# EasyEDA schematic schematic.json
TITLE: esp8266 wall wart; REV: 1.0; Date: 2017-07-03; Sheet: 1/1; Drawn By: gustavofbreunig
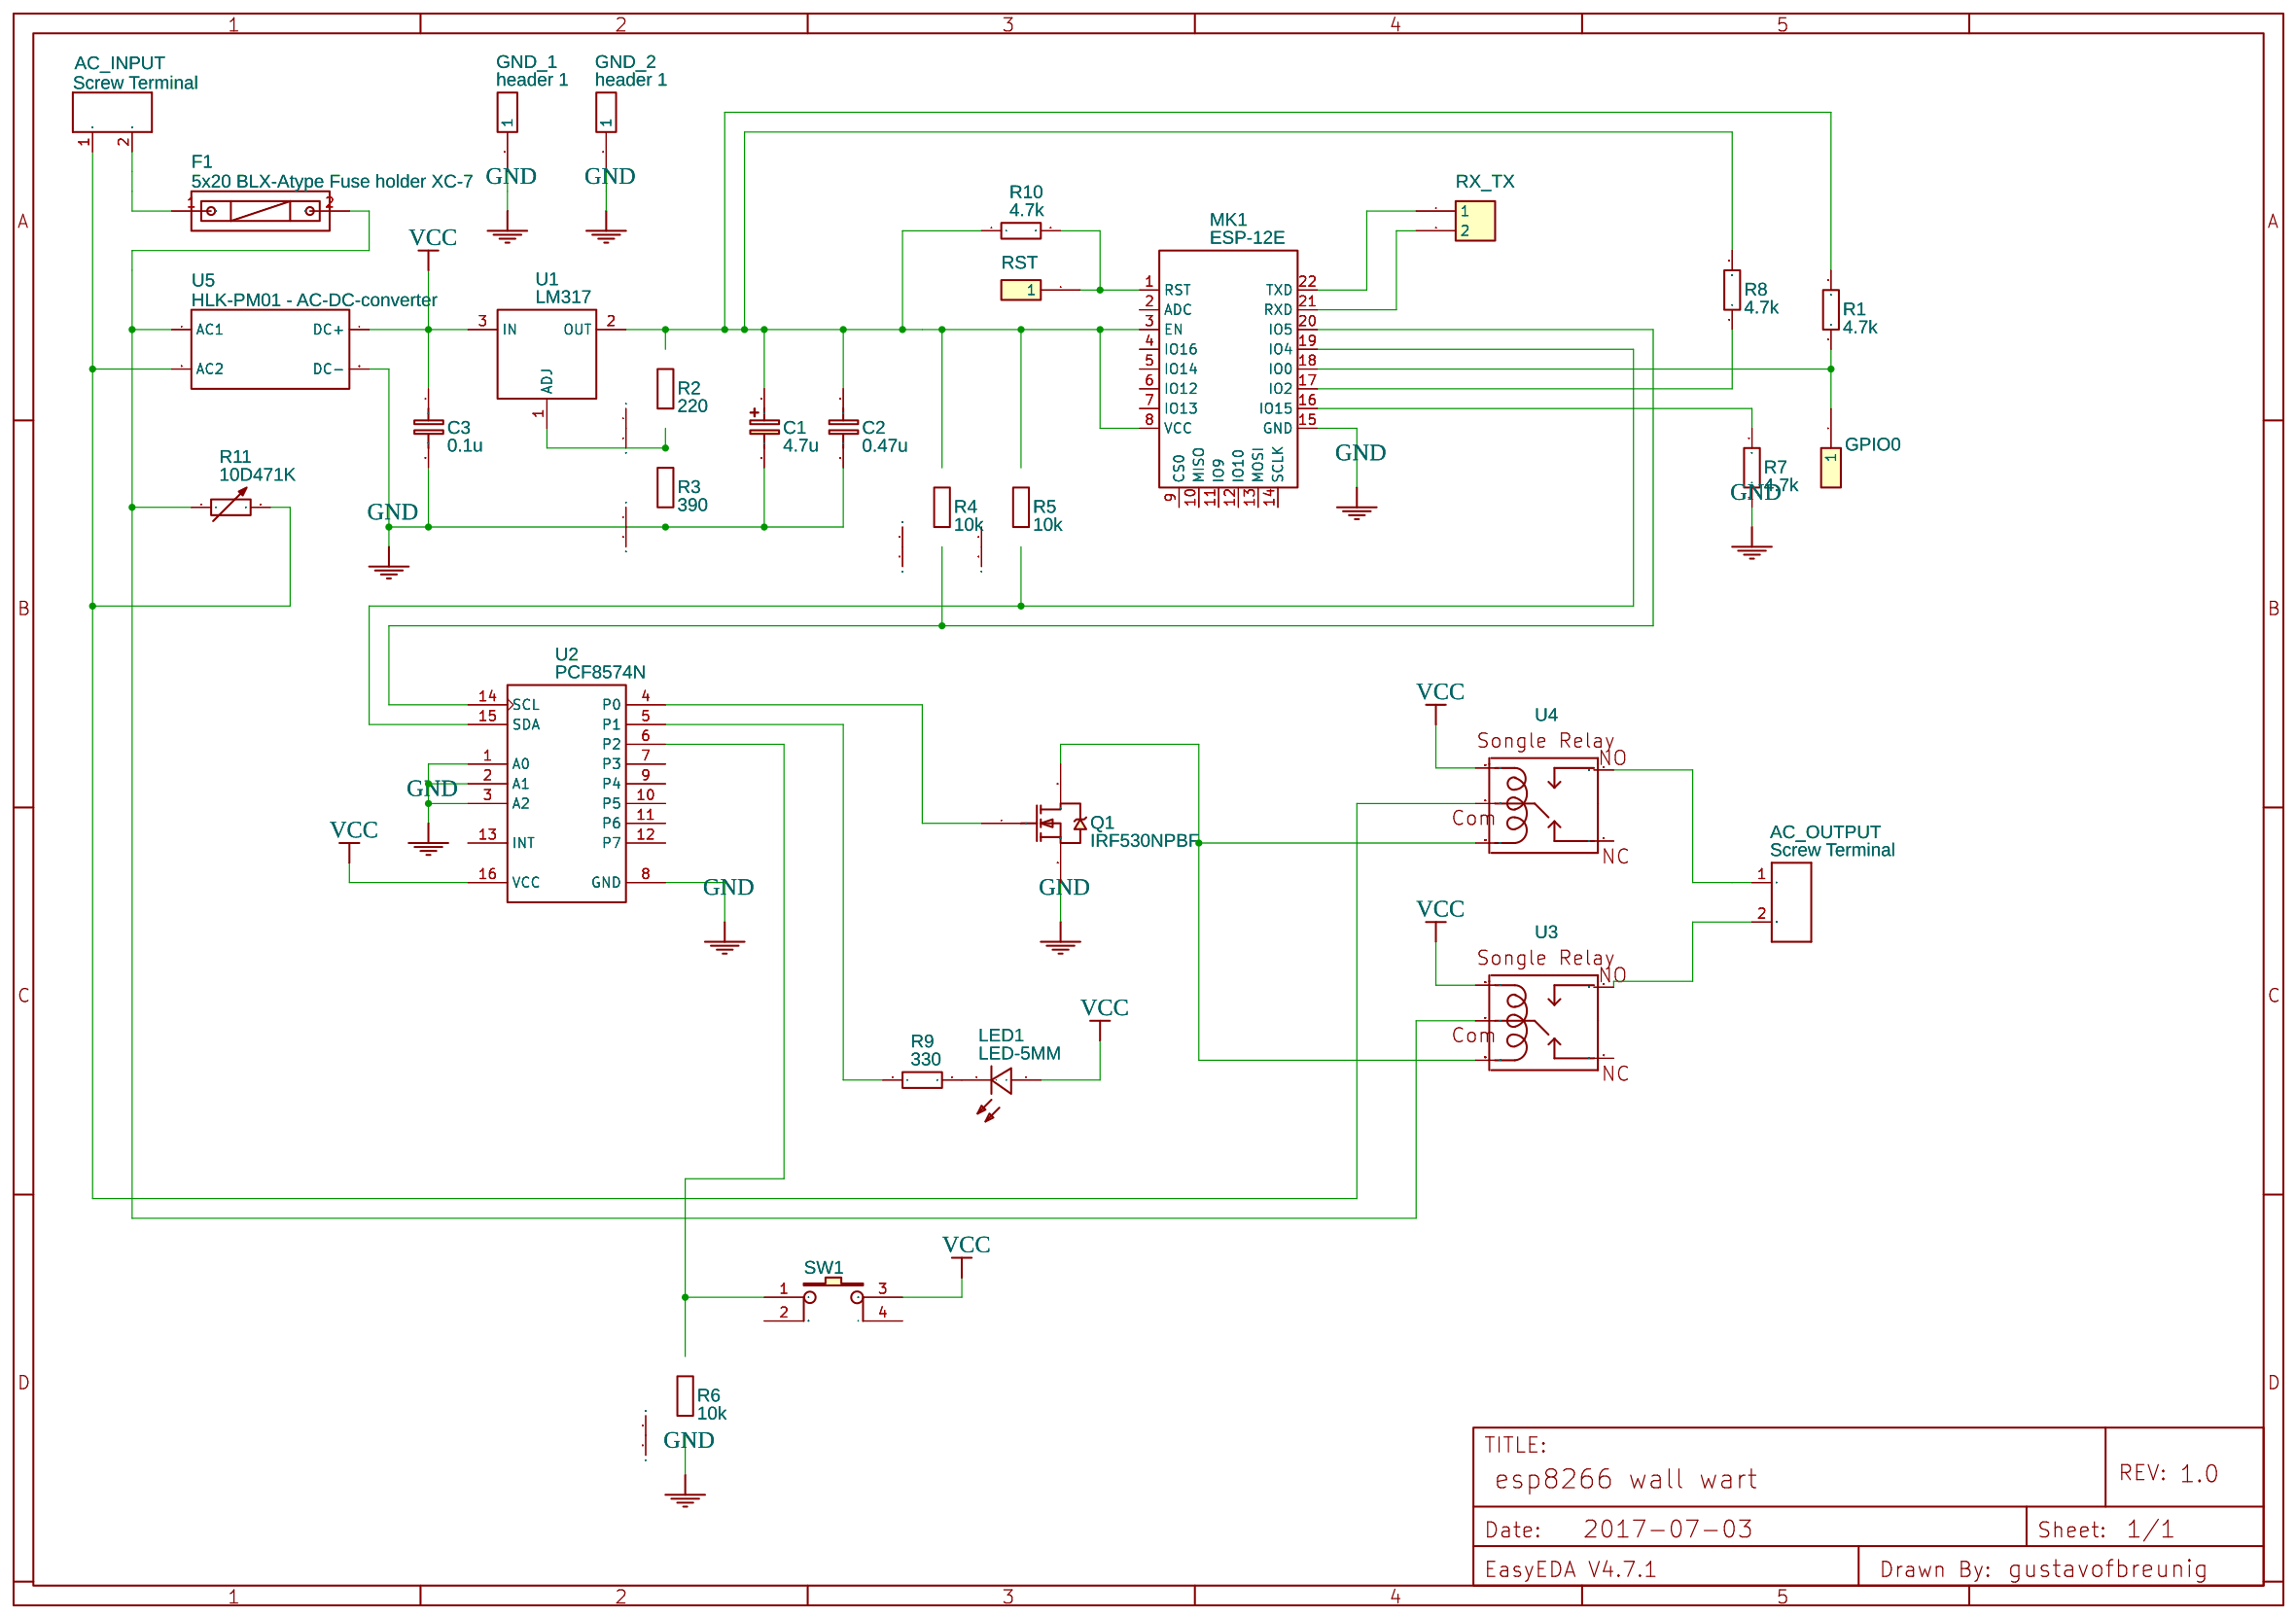
[diagram p0: schematic sheet]

## Parts
AC_INPUT  Screw Terminal  [H2-5.0-10.5X8.0MM]
AC_OUTPUT  Screw Terminal  [H2-5.0-10.5X8.0MM]
C1  4.7u  [CAP-D5.0XF2.0]
C2  0.47u  [RAD-0.1]
C3  0.1u  [RAD-0.1]
F1  5x20 BLX-Atype Fuse holder XC-7  [5X20-BLX-A]
GND_1  header 1  [HDR-1X1/2.54]
GND_2  header 1  [HDR-1X1/2.54]
GPIO0  Header-Male-2.54_1x1  [HDR-1X1/2.54]
LED1  LED-5MM  [LED-5MM/2.54]
MK1  ESP-12E  [ESP-12E]
Q1  IRF530NPBF  [TO-220(TO-220-3)]
R1  4.7k  [AXIAL-0.3]
R2  220  [AXIAL-0.3]
R3  390  [AXIAL-0.3]
R4  10k  [AXIAL-0.3]
R5  10k  [AXIAL-0.3]
R6  10k  [AXIAL-0.3]
R7  4.7k  [AXIAL-0.3]
R8  4.7k  [AXIAL-0.3]
R9  330  [AXIAL-0.3]
R10  4.7k  [AXIAL-0.3]
R11  10D471K  [PS-RES-12.5*6.7]
RST  Header-Male-2.54_1x1  [HDR-1X1/2.54]
RX_TX  Header-Female-2.54_1x2  [HDR-1X2/2.54]
SW1  SWITCH-6x6x5_TH  [SWITCH-6X6X5_TH]
U1  LM317  [TO-220]
U2  PCF8574N  [DIP16]
U3  SONGLE RELAY DPDT  [SONGLE POWER RELAY]
U4  SONGLE RELAY DPDT  [SONGLE POWER RELAY]
U5  HLK-PM01 - AC-DC-converter  [HLK-PM01]

## Library data of the parts
AC_INPUT AC_OUTPUT = -: Manufacturer Part: ?
C1-C3 = Capacitor: Manufacturer Part: ?
F1 = -: Supplier: LCSC; LCSC: C3131; Manufacturer: XCFuse; image: //image.lceda.cn/szlcsc/C3131.jpg
GND_1 GND_2 = -: Supplier: LCSC; Manufacturer: ReliaPro; Manufacturer Part: Header 1*1P; LCSC: C81276
GPIO0 RST = -: LCSC: C81276; Supplier: LCSC; Manufacturer: LCSC
LED1 = -: Supplier: LCSC; Manufacturer: EVERLIGHT; Manufacturer Part: 333-2UYC/S530-A3
MK1 = -: Supplier: LCSC; Manufacturer: AiThinker; LCSC: C89297
Q1 = -: LCSC: C2565; Supplier: LCSC; Manufacturer: IR
R1-R10 = Resistor: Manufacturer Part: ?
R11 = -: Supplier: LCSC; LCSC: C8760; Manufacturer: RUILON
RX_TX = -: LCSC: C49661; Supplier: LCSC; Manufacturer: LCSC
SW1 = -: LCSC: C69330; Supplier: LCSC; Manufacturer: LCSC
U1 = -: Supplier: LCSC; Manufacturer Part: CJ; LCSC: C22147
U2 = -: Remote 8-Bit IO Expander for I2C-Bus, 2.5 to 6 V, -40 to 85 degC, 16-pin PDIP (N), Pb-Free (RoHS); catid: 20; Manufacturer Part: ?
U3 U4 = -: catid: 20; Contributor: SparkFun; sourceId: htnFztLy4; Manufacturer Part: ?
U5 = -: sourceId: u1BzxTRca; Manufacturer Part: ?

## Nets
GND: C1.2 C2.2 C3.2 GND_1.1 GND_2.1 MK1.15(GND) Q1.3(S) R3.1 R6.1 R7.1 U2.1(A0) U2.2(A1) U2.3(A2) U2.8(GND) U5.3(DC-)
VCC: C3.1 LED1.1(+) SW1.3 U1.3(IN) U2.16(VCC) U3.COIL1 U4.COIL1 U5.4(DC+)
AC_INPUT_2: AC_INPUT.2 F1.1
MK1_1: MK1.1(RST) R10.2 RST.1
MK1_16: MK1.16(IO15) R7.2
MK1_17: MK1.17(IO2) R8.1
MK1_18: GPIO0.1 MK1.18(IO0) R1.1
MK1_19: MK1.19(IO4) R5.1 U2.15(SDA)
MK1_20: MK1.20(IO5) R4.1 U2.14(SCL)
MK1_21: MK1.21(RXD) RX_TX.2
MK1_22: MK1.22(TXD) RX_TX.1
Q1_2: Q1.2(D) U3.COIL2 U4.COIL2
R9_2: LED1.2(-) R9.2
U1_1: R2.1 R3.2 U1.1(ADJ)
U1_2: C1.1 C2.1 MK1.3(EN) MK1.8(VCC) R1.2 R2.2 R4.2 R5.2 R8.2 R10.1 U1.2(OUT)
U2_4: Q1.1(G) U2.4(P0)
U2_5: R9.1 U2.5(P1)
U2_6: R6.2 SW1.1 U2.6(P2)
U3_MAIN: F1.2 R11.1 U3.MAIN U5.1(AC1)
U3_NC: AC_OUTPUT.2 U3.NC
U4_MAIN: AC_INPUT.1 R11.2 U4.MAIN U5.2(AC2)
U4_NC: AC_OUTPUT.1 U4.NC

Not connected (* = marked no-connect by the designer): MK1 2(ADC) 4(IO16) 5(IO14) 6(IO12) 7(IO13) 9(CS0) 10(MISO) 11(IO9) 12(IO10) 13(MOSI) 14(SCLK); SW1 2 4; U2 7(P3) 9(P4) 10(P5) 11(P6) 12(P7) 13(INT); U3 NO; U4 NO
